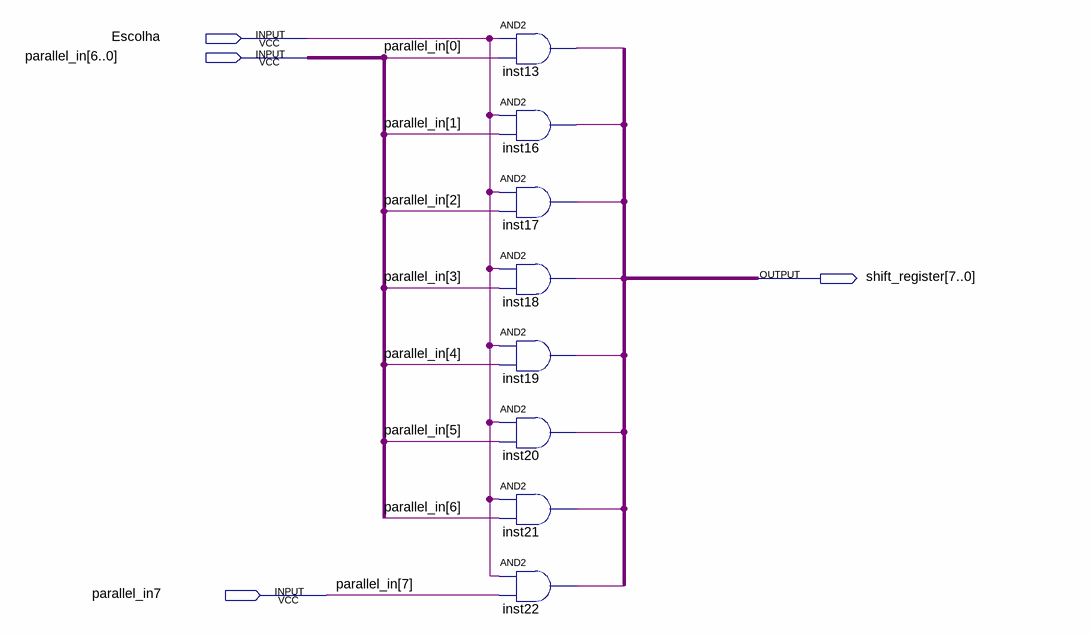
[diagram p0: schematic sheet]
// Quartus schematic Mult.bdf as structural Verilog: 8 symbols, 4 pins
module Mult (
  input  Escolha,
  input  [6:0] parallel_in,
  input  parallel_in7,
  output [7:0] shift_register
);

  wire inst13_out, inst16_out, inst17_out, inst18_out, inst19_out, inst20_out, inst21_out, inst22_out;

  and inst13 (inst13_out, Escolha, parallel_in[0]);
  and inst16 (inst16_out, Escolha, parallel_in[1]);
  and inst17 (inst17_out, Escolha, parallel_in[2]);
  and inst18 (inst18_out, Escolha, parallel_in[3]);
  and inst19 (inst19_out, Escolha, parallel_in[4]);
  and inst20 (inst20_out, Escolha, parallel_in[5]);
  and inst21 (inst21_out, Escolha, parallel_in[6]);
  and inst22 (inst22_out, Escolha, parallel_in7);
endmodule
